# EAGLE design ep_project_1 (EAGLE 9.6.2)

## Sheet 1 of 2
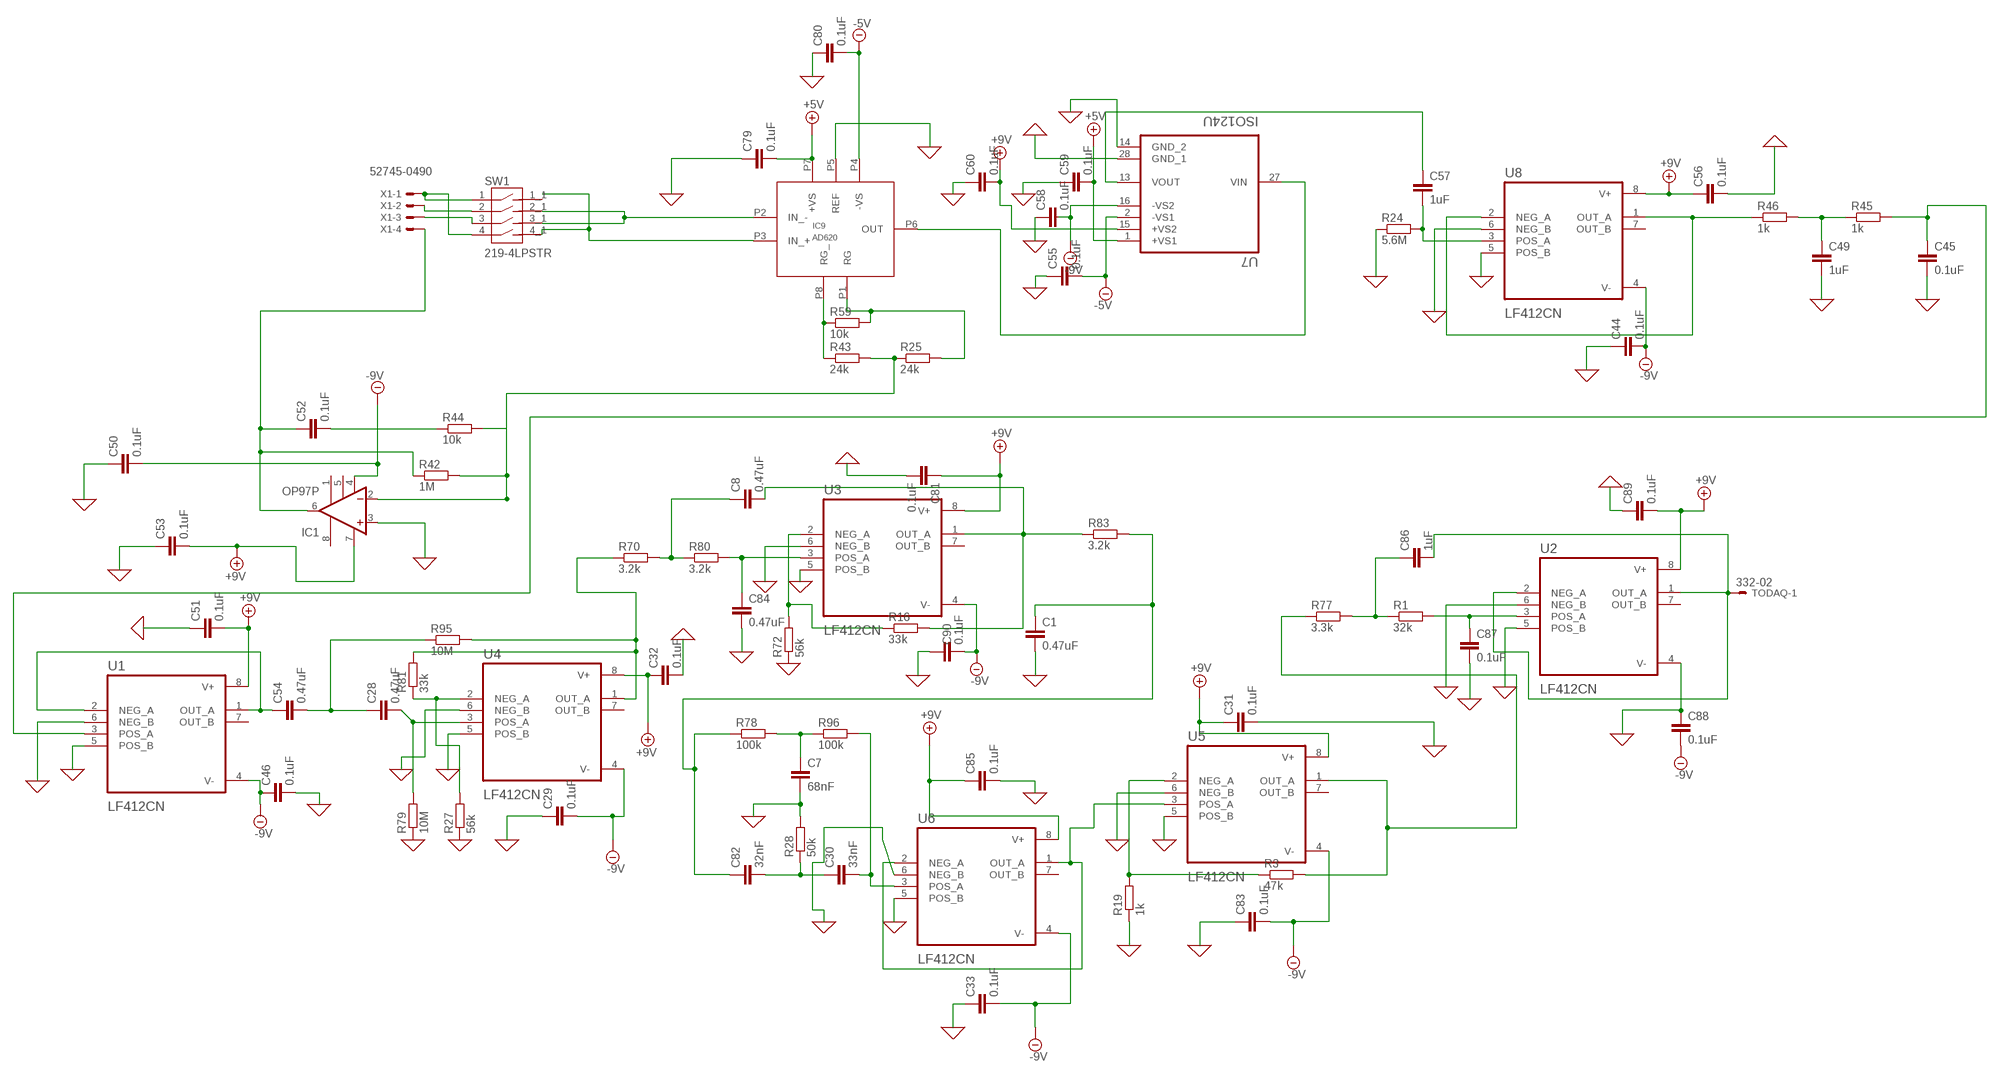
[diagram p0: schematic, sheet 1]

### Parts
C1  0.47uF  C-EU025-025X050  [C025-025X050]
C7  68nF  C-EU025-025X050  [C025-025X050]
C8  0.47uF  C-EU025-025X050  [C025-025X050]
C28  0.47uF  C-EU025-025X050  [C025-025X050]
C29  0.1uF  C-EU025-025X050  [C025-025X050]
C30  33nF  C-EU025-025X050  [C025-025X050]
C31  0.1uF  C-EU025-025X050  [C025-025X050]
C32  0.1uF  C-EU025-025X050  [C025-025X050]
C33  0.1uF  C-EU025-025X050  [C025-025X050]
C44  0.1uF  C-EU025-025X050  [C025-025X050]
C45  0.1uF  C-EU025-025X050  [C025-025X050]
C46  0.1uF  C-EU025-025X050  [C025-025X050]
C49  1uF  C-EU025-025X050  [C025-025X050]
C50  0.1uF  C-EU025-025X050  [C025-025X050]
C51  0.1uF  C-EU025-025X050  [C025-025X050]
C52  0.1uF  C-EU025-025X050  [C025-025X050]
C53  0.1uF  C-EU025-025X050  [C025-025X050]
C54  0.47uF  C-EU025-025X050  [C025-025X050]
C55  0.1uF  C-EU025-025X050  [C025-025X050]
C56  0.1uF  C-EU025-025X050  [C025-025X050]
C57  1uF  C-EU025-025X050  [C025-025X050]
C58  0.1uF  C-EU025-025X050  [C025-025X050]
C59  0.1uF  C-EU025-025X050  [C025-025X050]
C60  0.1uF  C-EU025-025X050  [C025-025X050]
C79  0.1uF  C-EU025-025X050  [C025-025X050]
C80  0.1uF  C-EU025-025X050  [C025-025X050]
C81  0.1uF  C-EU025-025X050  [C025-025X050]
C82  32nF  C-EU025-025X050  [C025-025X050]
C83  0.1uF  C-EU025-025X050  [C025-025X050]
C84  0.47uF  C-EU025-025X050  [C025-025X050]
C85  0.1uF  C-EU025-025X050  [C025-025X050]
C86  1uF  C-EU025-025X050  [C025-025X050]
C87  0.1uF  C-EU025-025X050  [C025-025X050]
C88  0.1uF  C-EU025-025X050  [C025-025X050]
C89  0.1uF  C-EU025-025X050  [C025-025X050]
C90  0.1uF  C-EU025-025X050  [C025-025X050]
IC1  OP97P  [DIL08]
IC9  AD620  [DIL8]
R1  32k  R-EU_0204/7  [0204/7]
R3  47k  R-EU_0204/7  [0204/7]
R16  33k  R-EU_VTA55  [VTA55]
R19  1k  R-EU_0204/7  [0204/7]
R24  5.6M  R-EU_0204/7  [0204/7]
R25  24k  R-EU_0204/7  [0204/7]
R27  56k  R-EU_0204/7  [0204/7]
R28  50k  R-EU_0204/7  [0204/7]
R42  1M  R-EU_0204/7  [0204/7]
R43  24k  R-EU_0204/7  [0204/7]
R44  10k  R-EU_0204/7  [0204/7]
R45  1k  R-EU_0204/7  [0204/7]
R46  1k  R-EU_0204/7  [0204/7]
R59  10k  R-EU_0204/7  [0204/7]
R70  3.2k  R-EU_0204/7  [0204/7]
R72  56k  R-EU_0204/7  [0204/7]
R77  3.3k  R-EU_0204/7  [0204/7]
R78  100k  R-EU_0204/7  [0204/7]
R79  10M  R-EU_0204/7  [0204/7]
R80  3.2k  R-EU_0204/7  [0204/7]
R81  33k  R-EU_0204/7  [0204/7]
R83  3.2k  R-EU_0204/7  [0204/7]
R95  10M  R-EU_0204/7  [0204/7]
R96  100k  R-EU_0204/7  [0204/7]
SW1  219-4LPSTR  [SW_219-4LPSTR]
TODAQ  332-02  [332-02]
U1  LF412CN  [DIP794W45P254L959H508Q8]
U2  LF412CN  [DIP794W45P254L959H508Q8]
U3  LF412CN  [DIP794W45P254L959H508Q8]
U4  LF412CN  [DIP794W45P254L959H508Q8]
U5  LF412CN  [DIP794W45P254L959H508Q8]
U6  LF412CN  [DIP794W45P254L959H508Q8]
U7  ISO124U  [SOIC127P1033X265-8N]
U8  LF412CN  [DIP794W45P254L959H508Q8]
X1  52745-0490  [52745-0490]

### Nets
0: C1.2 C7.2 C29.1 C31.2 C32.2 C33.1 C44.1 C45.2 C46.2 C49.2 C50.1 C51.1 C53.1 C55.1 C56.2 C58.1 C59.1 C60.1 C79.1 C80.1 C81.2 C83.1 C84.2 C85.2 C87.2 C88.1 C89.1 C90.1 IC1.3(+IN) IC9.P5(REF) R19.1 R24.1 R27.1 R28.2 R72.1 R79.1 U1.5(POS_B) U1.6(NEG_B) U2.4(V-) U2.5(POS_B) U2.6(NEG_B) U3.5(POS_B) U3.6(NEG_B) U4.5(POS_B) U4.6(NEG_B) U5.5(POS_B) U5.6(NEG_B) U6.5(POS_B) U6.6(NEG_B) U7.14(GND_2) U7.28(GND_1) U8.5(POS_B) U8.6(NEG_B) ; supply symbol labelled GND
+5V: C59.2 C79.2 IC9.P7(+VS) U7.1(+VS1)
+9V: C31.1 C32.1 C51.2 C53.2 C56.1 C60.2 C81.1 C85.1 C89.2 IC1.7(V+) U1.8(V+) U2.8(V+) U3.8(V+) U4.8(V+) U5.8(V+) U6.8(V+) U7.15(+VS2) U8.8(V+)
-5V: C55.2 C80.2 IC9.P4(-VS) U7.2(-VS1)
-9V: C29.2 C33.2 C44.2 C46.1 C50.2 C58.2 C83.2 C88.2 C90.2 IC1.4(V-) U1.4(V-) U3.4(V-) U4.4(V-) U5.4(V-) U6.4(V-) U7.16(-VS2) U8.4(V-)
N$1: R3.2 R77.1 U5.1(OUT_A)
N$2: C45.1 R45.2 U1.3(POS_A)
N$4: IC9.P8(RG_) R43.1 R59.1
N$5: C52.2 R44.1
N$6: IC1.2(-IN) R25.1 R42.2 R43.2 R44.2
N$7: C28.2 R79.2 U4.3(POS_A)
N$8: C28.1 C54.2 R95.1
N$9: R27.2 R81.1 U4.2(NEG_A)
N$10: C30.2 R96.2 U6.3(POS_A)
N$11: C1.1 C82.1 R78.1 R83.2
N$12: C7.1 R78.2 R96.1
N$13: IC9.P6(OUT) U7.27(VIN)
N$14: C30.1 C82.2 R28.1
N$15: U5.3(POS_A) U6.1(OUT_A) U6.2(NEG_A)
N$16: R3.1 R19.2 U5.2(NEG_A)
N$17: C49.1 R45.1 R46.2
N$18: C8.1 R70.2 R80.1
N$19: C84.1 R80.2 U3.3(POS_A)
N$20: R16.1 R72.2 U3.2(NEG_A)
N$21: C86.1 R1.1 R77.2
N$22: IC9.P3(IN_+) SW1.4_1
N$23: IC9.P2(IN_-) SW1.2_1 SW1.3_1
N$24: IC9.P1(RG) R25.2 R59.2
N$26: SW1.1 SW1.4 X1.1
N$27: C57.1 U7.13(VOUT)
N$28: C8.2 R16.2 R83.1 U3.1(OUT_A)
N$29: C87.1 R1.2 U2.3(POS_A)
N$30: SW1.3 X1.3
N$31: C54.1 U1.1(OUT_A) U1.2(NEG_A)
N$33: SW1.2 X1.2
N$34: R70.1 R81.2 R95.2 U4.1(OUT_A)
N$35: C52.1 IC1.6(OUT) R42.1 X1.4
N$36: C57.2 R24.2 U8.3(POS_A)
N$37: R46.1 U8.1(OUT_A) U8.2(NEG_A)
N$38: C86.2 TODAQ.1 U2.1(OUT_A) U2.2(NEG_A)
Unconnected: IC1.1(BAL1) IC1.5(COMP) IC1.8(BAL2) SW1.1_1 TODAQ.2 U1.7(OUT_B) U2.7(OUT_B) U3.7(OUT_B) U4.7(OUT_B) U5.7(OUT_B) U6.7(OUT_B) U8.7(OUT_B)

## Sheet 2 of 2

## Library data of the parts
C1 C7 C8 C28-C33 C44-C46 C49-C60 C79-C90 = rcl:C-EU: CAPACITOR, European symbol; SPICEPREFIX: C
IC1 = linear:OP97: Low Power, High Precision Operational Amplifier Source: http://www.analog.com/static/imported-files/data_sheets/OP97.pdf
IC9 = ad620:AD620
R1 R3 R16 R19 R24 R25 R27 R28 R42-R46 R59 R70 R72 R77-R81 R83 R95 R96 = rcl:R-EU_: RESISTOR, European symbol; SPICEPREFIX: R
SW1 = 219-4LPSTR:219-4LPSTR: Switch DIP ON OFF SPST 4 Flush Slide 0.1A 20VDC Gull Wing 2.54mm SMD T/R Check availability <https://pricing.snapeda.com/parts/219-4LPSTR/CTS%20Electrocomponents/view-part?ref=eda> Check availability <https://pricing.snapeda.com/parts/219-4LPSTR/CTS%20Electrocomponents/view-part?ref=eda>; AVAILABILITY: In Stock; CHECK_PRICES: https://www.snapeda.com/parts/219-4LPSTR/CTS+Electrocomponents/view-part/?ref=eda; DESCRIPTION: Dip Switch SPST 4 Position Surface Mount Slide (Standard) Actuator 100mA 20VDC; MF: CTS Electrocomponents; MP: 219-4LPSTR; PACKAGE: None; PRICE: None; PURCHASE-URL: https://www.snapeda.com/api/url_track_click_mouser/?unipart_id=615801&manufacturer=CTS Electrocomponents&part_name=219-4LPSTR&search_term=dip switch 4; SNAPEDA_LINK: https://www.snapeda.com/parts/219-4LPSTR/CTS+Electrocomponents/view-part/?ref=snap
TODAQ = con-garry:332-02: 2 Pin - 2mm Dual Row Source: www.mpe-connector.de / garry_shortform_2012.pdf
U1-U6 U8 = LF412CN (1):LF412CN: Check availability <https://pricing.snapeda.com/parts/LF412CN/Texas%20Instruments/view-part?ref=eda>; AVAILABILITY: In Stock; CHECK_PRICES: https://www.snapeda.com/parts/LF412CN/Texas+Instruments/view-part/?ref=eda; DESCRIPTION: IC, OP AMP, DUAL JFET, DIP8, 412; Op Amp Type:High Speed; No. of Amplifiers:2; Slew Rate:15V/µs; Supply Voltage Range:10V to 36V; Amplifier Case Style:DIP; No. of Pins:8; Bandwidth:3MHz; Operating Temperature Min:0°C; Operating Temperature Max:70°C; MSL:MSL 1 - Unlimited; SVHC:No SVHC (20-Jun-2013); Amplifier Type:JFET Operational; Base Number:412; Device Marking:LF412CN; Gain Bandwidth:4MHz; IC Generic Number:412; IC Temperature Range:Commercial; Input Offset Voltage Max:3mV; Logic Function Number:412; Operating Temperature Range:0°C to +70°C; Operational Amplifier Features:Low Offset; Package / Case:DIP; Supply Voltage + Nom:15V; Supply Voltage Max:36V; Supply Voltage Min:10V; MF: Texas Instruments; MP: LF412CN; PACKAGE: DIP-8 Texas Instruments; PRICE: None; PURCHASE-URL: https://www.snapeda.com/api/url_track_click_mouser/?unipart_id=20575&manufacturer=Texas Instruments&part_name=LF412CN&search_term=lf412cn; SNAPEDA_LINK: https://www.snapeda.com/parts/LF412CN/Texas+Instruments/view-part/?ref=snap
U7 = ISO124U:ISO124U; CHECK_PRICES: https://www.snapeda.com/parts/ISO124U/Texas+Instruments/view-part/?ref=eda; DESCRIPTION: &plusmn;10-V input, precision voltage sensing low-cost isolated amplifier; MF: Texas Instruments; MP: ISO124U; PACKAGE: SOIC-8 Texas Instruments; PURCHASE-URL: https://www.snapeda.com/api/url_track_click_mouser/?unipart_id=2459575&manufacturer=Texas Instruments&part_name=ISO124U&search_term=iso124; SNAPEDA_LINK: https://www.snapeda.com/parts/ISO124U/Texas+Instruments/view-part/?ref=snap
X1 = con-molex:52745-0490: FFC/FPC-to-Board 0.50mm (.020") SMT Top Contact Right Angle, ZIF, Style Receptacle 52745 / 52435 Source: http://www.molex.com/product/ffc/52745.html; MF: MOLEX; MPN: 52745-0490; OC_FARNELL: unknown; OC_NEWARK: 61H4699

## Board
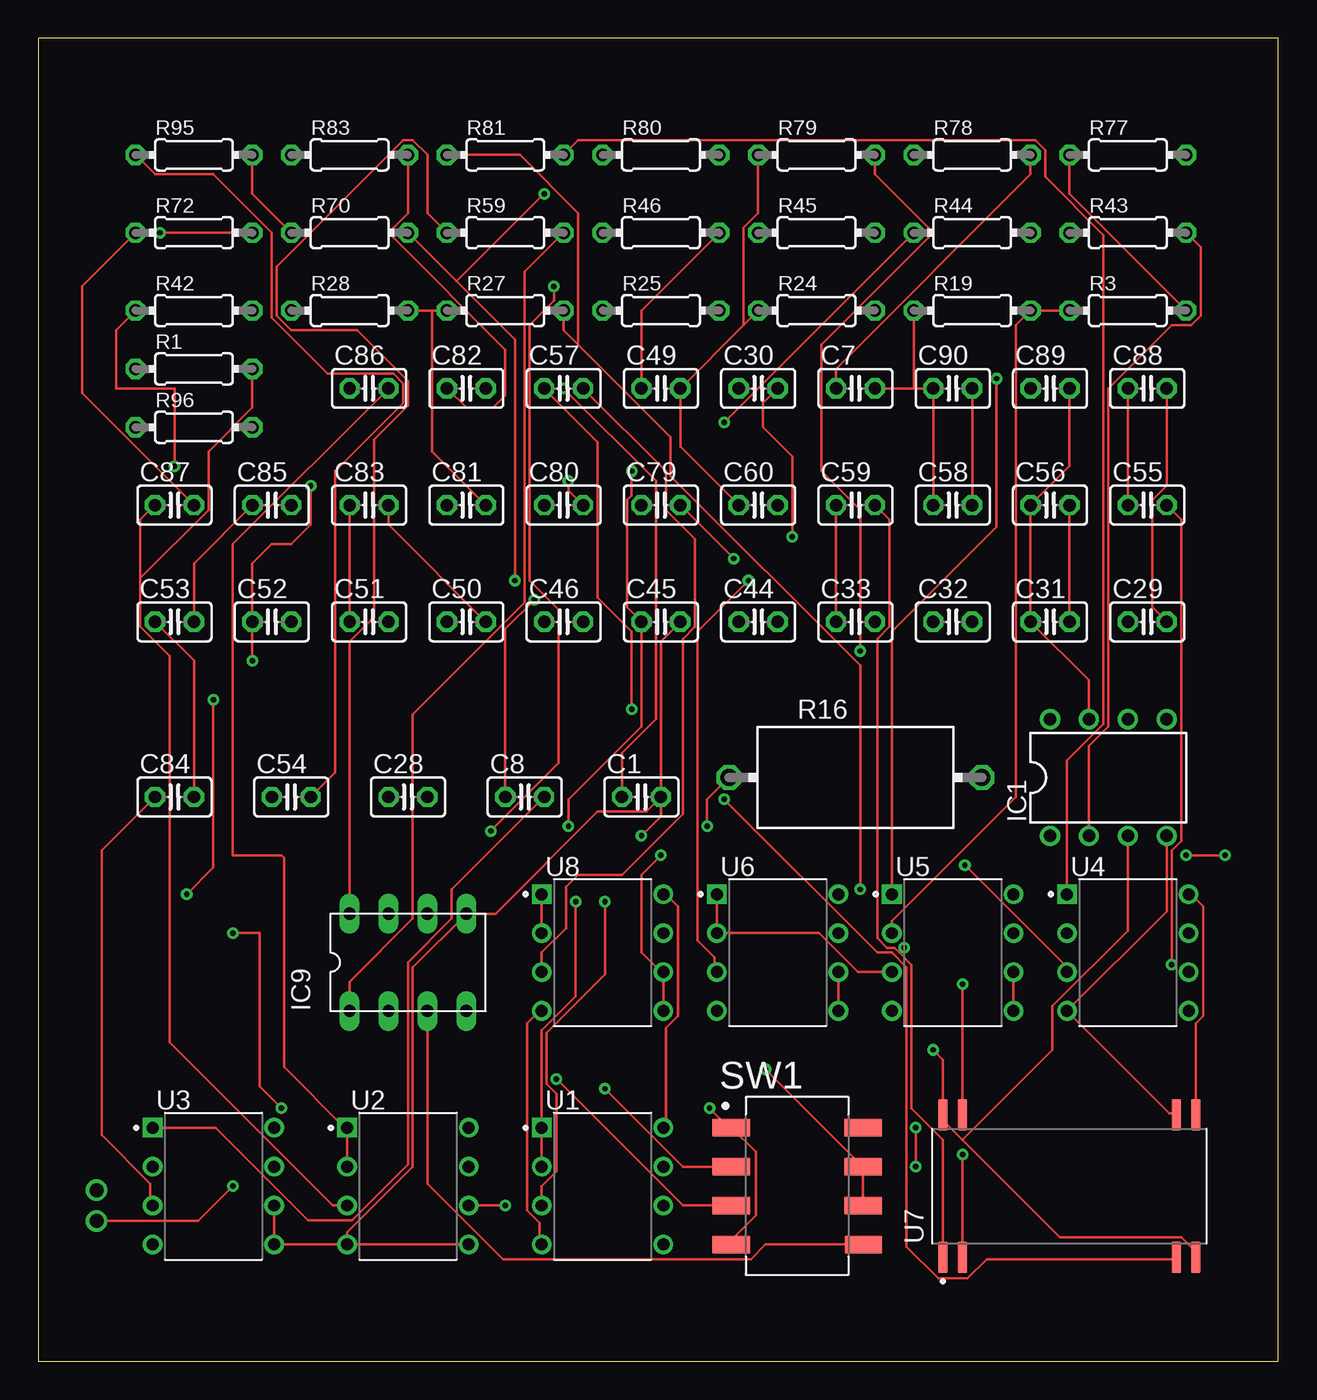
[diagram p1: board, top side]
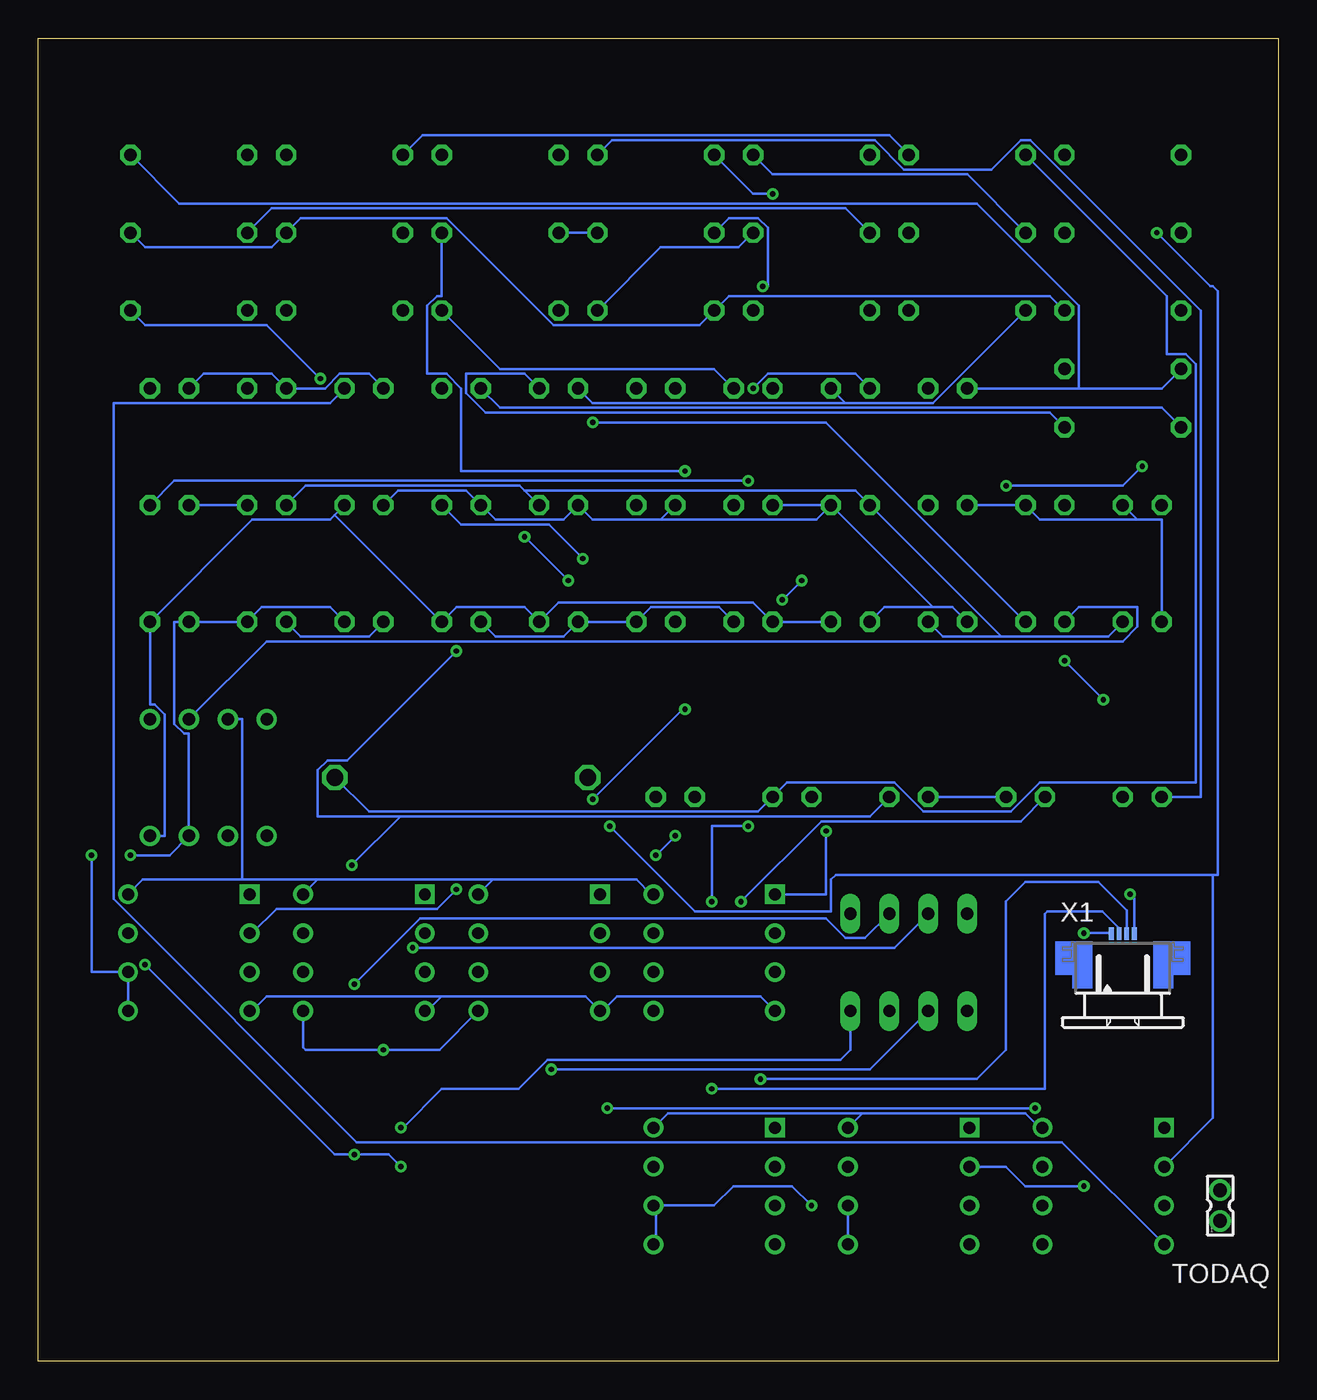
[diagram p2: board, bottom side, seen from below]

Size 80.95 x 86.35 mm. Coordinates in mm from the lower left corner, seen from the top.
Outline: 0,0 80.95,0 80.95,86.35 0,86.35 0,0
Copper layers (1*16): Top 0.035mm / dielectric 1.5mm / Bottom 0.035mm
Design rules "default": minimum track width 6mil, minimum drill 0.35mm, track to track 6mil, track to pad 6mil, pad to pad 6mil, via to via 6mil, smd to smd 6mil, copper to edge 40mil, drill to drill 6mil, minimum pad ring 10mil, minimum via ring 8mil, stop-mask expansion 4mil, vias tented up to drill 0mil, thermal gap 10mil

### Footprints (pad centres in the part's own frame; a part is rotated, then mirrored left to right if it is on the bottom)
C025-025X050 = drill 0.813 octagon: 1 -1.27,0; 2 1.27,0
DIL08 = drill 0.813 pad 1.27: 1 -3.81,-3.81; 2 -1.27,-3.81; 3 1.27,-3.81; 4 3.81,-3.81; 5 3.81,3.81; 6 1.27,3.81; 7 -1.27,3.81; 8 -3.81,3.81
DIL8 = drill 0.8 long: P1 -3.81,2.54; P2 -1.27,2.54; P3 1.27,2.54; P4 3.81,2.54; P5 3.81,8.89; P6 1.27,8.89; P7 -1.27,8.89; P8 -3.81,8.89
0204/7 = drill 0.813 octagon: 1 -3.81,0; 2 3.81,0
VTA55 = drill 1.1 octagon: 1 -8.255,0; 2 8.255,0
SW_219-4LPSTR = smd 2.44 x 1.13: 1 -4.305,3.81; 1_1 4.305,3.81; 2 -4.305,1.27; 2_1 4.305,1.27; 3 -4.305,-1.27; 3_1 4.305,-1.27; 4 -4.305,-3.81; 4_1 4.331,-3.81
332-02 = drill 0.9 pad 1.27: 1 0,-1; 2 0,1
DIP794W45P254L959H508Q8 = drill 0.78 pad 1.13 square: 1 -3.97,3.81 | drill 0.78 pad 1.13: 2 -3.97,1.27; 3 -3.97,-1.27; 4 -3.97,-3.81; 5 3.97,-3.81; 6 3.97,-1.27; 7 3.97,1.27; 8 3.97,3.81
SOIC127P1033X265-8N = smd 2.05 x 0.6: 1 -4.655,8.255; 2 -4.655,6.985; 13 -4.655,-6.985; 14 -4.655,-8.255; 15 4.655,-8.255; 16 4.655,-6.985; 27 4.655,6.985; 28 4.655,8.255
52745-0490 = smd 0.3 x 0.8: 1 -0.75,2.5; 2 -0.25,2.5; 3 0.25,2.5; 4 0.75,2.5

### Placement (x,y rotation side)
C1  39.37,36.83 0 top
C7  53.34,63.5 0 top
C8  31.75,36.83 0 top
C28  24.13,36.83 0 top
C29  72.39,48.26 0 top
C30  46.99,63.5 0 top
C31  66.04,48.26 0 top
C32  59.69,48.26 0 top
C33  53.34,48.26 0 top
C44  46.99,48.26 0 top
C45  40.64,48.26 0 top
C46  34.29,48.26 0 top
C49  40.64,63.5 0 top
C50  27.94,48.26 0 top
C51  21.59,48.26 0 top
C52  15.24,48.26 0 top
C53  8.89,48.26 0 top
C54  16.51,36.83 0 top
C55  72.39,55.88 0 top
C56  66.04,55.88 0 top
C57  34.29,63.5 0 top
C58  59.69,55.88 0 top
C59  53.34,55.88 0 top
C60  46.99,55.88 0 top
C79  40.64,55.88 0 top
C80  34.29,55.88 0 top
C81  27.94,55.88 0 top
C82  27.94,63.5 0 top
C83  21.59,55.88 0 top
C84  8.89,36.83 0 top
C85  15.24,55.88 0 top
C86  21.59,63.5 0 top
C87  8.89,55.88 0 top
C88  72.39,63.5 0 top
C89  66.04,63.5 0 top
C90  59.69,63.5 0 top
IC1  69.85,38.1 0 top
IC9  24.13,20.32 0 top
R1  10.16,64.77 0 top
R3  71.12,68.58 0 top
R16  53.34,38.1 0 top
R19  60.96,68.58 0 top
R24  50.8,68.58 0 top
R25  40.64,68.58 0 top
R27  30.48,68.58 0 top
R28  20.32,68.58 0 top
R42  10.16,68.58 0 top
R43  71.12,73.66 0 top
R44  60.96,73.66 0 top
R45  50.8,73.66 0 top
R46  40.64,73.66 0 top
R59  30.48,73.66 0 top
R70  20.32,73.66 0 top
R72  10.16,73.66 0 top
R77  71.12,78.74 0 top
R78  60.96,78.74 0 top
R79  50.8,78.74 0 top
R80  40.64,78.74 0 top
R81  30.48,78.74 0 top
R83  20.32,78.74 0 top
R95  10.16,78.74 0 top
R96  10.16,60.96 0 top
SW1  49.53,11.43 0 top
TODAQ  3.81,10.16 0 bottom
U1  36.83,11.43 0 top
U2  24.13,11.43 0 top
U3  11.43,11.43 0 top
U4  71.12,26.67 0 top
U5  59.69,26.67 0 top
U6  48.26,26.67 0 top
U7  67.31,11.43 90 top
U8  36.83,26.67 0 top
X1  10.16,25.4 0 bottom

### Tracks (layer width: path | path; a pad name or v marks a point on that pad's centre or on a via)
0  (via drill 0.35)
  Top 0.152: 60.33,14.45 66.67,8.1 74.61,8.1 75.56,7.14 U7.14 | 60.33,14.45 59.05,15.72 U7.28 59.05,19.68 v58.42,20.32 | C31.2 C56.2 | C55.1 C88.1 | 60.33,14.45 66.2,20.32 66.2,23.18 71.12,28.1 IC1.3 | R27.1 25.72,68.58 | 25.72,68.58 R28.2 | C83.1 C51.1 | 25.72,68.58 25.72,59.37 C81.2 | C84.2 10.16,45.72 C53.1 | C87.2 2.86,63.18 2.86,70.17 R72.1 | U2.4 20.16,8.41 24.45,12.7 24.45,25.72 IC9.P5 29.84,29.21 36.51,35.88 39.69,35.88 C1.2 | C1.2 40.64,46.99 C45.2 | R24.1 46.04,67.63 | 46.04,67.63 C49.2 41.91,59.69 C60.1 | R79.1 46.99,74.93 46.04,73.98 46.04,67.63 | C58.1 C90.1 57.15,63.5 | 57.15,63.5 C7.2 | 57.15,63.5 R19.1 | C59.1 C33.1 | U3.6 U3.5 U2.4 | U2.4 U2.5 | U2.6 v30.48,10.16 | U6.6 U6.5 | U8.5 U8.6 40.64,25.4 39.37,26.67 39.37,31.75 v40.64,33.02 | C1.2 40.64,35.56 v39.37,34.29 | U5.6 U5.5 | v77.47,33.02 v74.93,33.02
  Bottom 0.152: C88.1 70.17,64.45 65.72,64.45 C89.1 62.23,63.5 61.28,64.45 59.37,64.45 C90.1 | C55.1 C56.2 | C32.2 61.91,49.21 66.36,49.21 C31.2 C29.1 72.07,48.26 72.07,41.59 71.44,40.96 71.12,40.96 IC1.3 72.39,33.02 v74.93,33.02 | C50.1 25.72,49.21 22.54,49.21 | 22.54,49.21 21.27,49.21 C51.1 | C83.1 C85.2 15.56,54.93 9.21,54.93 | 22.54,49.21 C81.2 | C53.1 7.62,54.93 9.21,54.93 | C87.2 9.21,54.93 | C46.2 36.51,49.21 40.96,49.21 C45.2 C44.1 46.67,47.31 51.12,47.31 C33.1 | 40.32,54.93 C79.1 | 40.32,54.93 44.77,54.93 C60.1 46.67,54.93 51.12,54.93 C59.1 53.02,56.83 57.47,56.83 C58.1 | C81.2 30.16,54.93 40.32,54.93 | v30.48,10.16 31.75,11.43 35.56,11.43 36.83,10.16 40.64,10.16 | 40.64,10.16 U1.6 | v39.37,34.29 v40.64,33.02 | C81.2 C80.1 | U6.5 54.77,20.32 v58.42,20.32 63.5,20.32 63.66,20.48 U5.5 | U1.5 40.64,7.78 40.64,10.16 | U2.5 U2.6 | U4.5 U4.6 77.47,25.4 v77.47,33.02
+5V  (via drill 0.35)
  Top 0.152: U7.1 59.05,14.45 56.99,16.51 56.99,25.88 56.2,26.67 | 56.2,26.67 55.88,26.99 55.4,26.99 54.77,27.62 54.77,47.15 55.56,47.94 55.56,54.93 C59.2 | 56.2,26.67 v56.52,26.99 | v45.4,52.39 C79.2
  Bottom 0.152: IC9.P7 25.08,26.99 v56.52,26.99 | v45.4,52.39 47.62,54.61 53.34,54.61 C59.2
+9V
  Top 0.152: U7.15 75.56,22.07 76.04,22.54 76.04,29.69 75.25,30.48 U4.8 | U1.8 40.96,15.24 40.96,21.75 41.75,22.54 41.75,29.69 40.96,30.48 U8.8 | C53.2 10.16,52.07 C85.1 | IC1.7 68.58,44.45 C31.1 C56.1 67.31,58.42 C89.2
  Bottom 0.152: 27.15,16.19 16.51,16.19 15.56,15.24 U3.8 | 27.15,16.19 U2.8 | 27.15,16.19 39.85,16.19 U1.8 | 51.28,31.43 41.91,31.43 40.96,30.48 U8.8 | 51.28,31.43 U6.8 | 62.71,31.43 U5.8 | 51.28,31.43 62.71,31.43 | 62.71,31.43 67.63,31.43 | 67.63,31.43 74.14,31.43 U4.8 | C51.2 21.91,47.31 18.1,47.31 | 18.1,47.31 11.11,47.31 C53.2 | 18.1,47.31 C81.1 27.62,56.83 49.21,56.83 | C32.1 59.37,47.31 63.82,47.31 C31.1 | 49.21,56.83 49.53,57.15 63.5,57.15 C56.1 | 49.21,56.83 C60.2 | 67.63,31.43 67.63,41.91 IC1.7
-5V  (via drill 0.35)
  Top 0.152: v60.33,13.49 U7.2 | v73.98,25.88 73.98,33.34 74.61,33.97 74.61,54.93 C55.2 | v57.28,15.24 57.28,12.83 57.15,12.7 v57.28,12.7 | C80.2 34.61,56.83 v34.61,57.47
  Bottom 0.152: v73.98,25.88 61.59,13.49 v60.33,13.49 58.07,13.49 v57.28,12.7 | v34.61,57.47 72.07,57.47 C55.2 | IC9.P4 27.94,20.32 28.6,19.66 47.72,19.66 49.59,17.78 54.61,17.78 57.15,15.24 v57.28,15.24
-9V
  Top 0.152: C83.2 22.86,54.61 C50.2 | C88.2 73.66,57.15 72.71,56.2 72.71,49.21 C29.2 | U4.4 73.82,16.19 74.3,16.19 U7.16 | IC1.4 73.66,29.37 U4.4 | U4.4 | U1.4 32.7,7.62 32.7,9.05 31.91,9.84 31.91,22.07 32.7,22.86 U8.4 | C90.2 C58.2
  Bottom 0.152: C50.2 C46.1 34.29,49.53 46.99,49.53 C44.2 49.21,49.21 53.66,49.21 C33.2 61.59,55.24 | C58.2 61.59,55.24 | 61.59,55.24 61.91,54.93 66.99,54.93 C29.2 73.66,42.86 73.34,42.86 72.71,42.23 72.71,34.29 IC1.4 | 54.61,23.81 45.24,23.81 U6.4 44.13,22.86 43.18,23.81 33.81,23.81 U8.4 | 54.61,23.81 55.56,22.86 U5.4 | 54.61,23.81 66.04,23.81 66.99,22.86 U4.4 | C90.2 61.91,62.55 76.04,62.55 76.04,30.16 60.17,14.29 14.13,14.29 U3.4
N$1  (via drill 0.35)
  Top 0.152: v62.55,64.14 62.55,54.45 55.72,47.62 U5.1 | R77.1 67.31,76.2 R3.2
  Bottom 0.152: v62.55,64.14 66.04,67.63 73.98,67.63 R3.2
N$2  (via drill 0.35)
  Top 0.152: v36.99,30 36.99,25.24 33.18,21.43 33.18,18.1 33.81,17.46 33.81,12.38 32.86,11.43 U1.3 | v34.61,34.92 34.61,36.67 39.37,41.43 C45.1 38.42,49.21 38.42,56.2 38.73,56.52 v38.73,58.1
  Bottom 0.152: v36.99,30 36.99,34.92 v34.61,34.92 | R45.2 54.61,69.53 54.93,69.53 55.56,68.9 55.56,64.45 54.29,64.45 53.34,63.5 53.34,58.1 v38.73,58.1
N$4
  Top 0.152: IC9.P8 20.32,46.99 21.91,48.58 21.91,60.17 24.13,62.39 24.13,63.98 20.8,67.31 16.51,67.31 15.56,68.26 15.56,71.44 23.81,79.69 24.45,79.69 25.4,78.74 25.4,74.93 R59.1
  Bottom 0.152: R43.1 65.72,75.25 28.26,75.25 R59.1
N$5  (via drill 0.35)
  Top 0.152: R44.1 v44.77,61.28
  Bottom 0.152: C52.2 29.53,61.28 v44.77,61.28
N$6
  Top 0.152: IC1.2 68.58,40.16 69.85,41.43 69.85,63.5 73.98,67.63 75.25,67.63 75.88,68.26 75.88,72.71 R43.2
  Bottom 0.152: R42.2 14.92,69.53 35.88,69.53 R25.1 37.78,67.63 47.31,67.63 54.29,74.61 63.82,74.61 R44.2 65.72,72.71 73.98,72.71 R43.2
N$7  (via drill 0.35)
  Top 0.152: v60.48,32.38 66.99,25.88 66.99,25.4 U4.3 | R79.2 54.61,77.47 58.1,73.98 58.1,73.34 51.12,66.36 51.12,58.1 53.66,55.56 v53.66,46.35
  Bottom 0.152: 57.31,35.56 v60.48,32.38 | 57.31,35.56 26.67,35.56 C28.2 | v53.66,46.35 60.8,39.21 62.07,39.21 62.71,38.58 62.71,35.56 57.31,35.56
N$8
  Top 0.152: R95.1 7.62,77.47 11.43,77.47 15.24,73.66 15.24,68.1 18.89,64.45 23.18,64.45 23.81,63.82 23.81,62.55 19.37,58.1 19.37,38.42 C54.2
  Bottom 0.152: C28.1 C54.2
N$9  (via drill 0.35)
  Top 0.152: v53.66,30.8 53.66,45.4 41.27,57.78 41.27,60.33 35.24,66.36 | 35.24,66.36 34.29,67.31 R27.2 | R81.1 31.43,78.74 35.24,74.93 35.24,66.36
  Bottom 0.152: v53.66,30.8 54.93,29.53 65.41,29.53 66.99,27.94 U4.2
N$10  (via drill 0.35)
  Top 0.152: v46.35,50.96 43.02,47.62 43.02,27.46 44.13,26.35 44.13,25.4 U6.3 | v49.21,53.82 49.21,59.05 47.31,60.96 47.31,62.55 C30.2
  Bottom 0.152: v49.21,53.82 v46.35,50.96 | R96.2 14.92,61.91 51.75,61.91 53.02,63.18 53.02,64.45 49.21,64.45 C30.2
N$11  (via drill 0.35)
  Top 0.152: C1.1 38.1,39.69 40.32,41.91 40.32,57.47 v34.29,63.5 | R83.2 24.13,74.93 23.18,73.98 23.18,73.34 30.48,66.04 30.48,63.02 29.69,62.23 27.94,62.23 C82.1
  Bottom 0.152: R83.2 25.4,80.01 55.88,80.01 R78.1 | v34.29,63.5 33.34,64.45 27.62,64.45 C82.1
N$12
  Top 0.152: R78.2 64.77,77.47 52.07,64.77 C7.1
  Bottom 0.152: R96.1 7.62,62.23 50.8,62.23 C7.1
N$13  (via drill 0.35)
  Top 0.152: v60.33,24.61 U7.27
  Bottom 0.152: v60.33,24.61 56.04,28.89 29.53,28.89 28.26,27.62 26.99,27.62 IC9.P6
N$14
  Bottom 0.152: 28.26,62.55 C82.2 | 28.26,62.55 22.54,62.55 R28.1 | C30.1 44.77,62.55 28.26,62.55
N$15
  Top 0.152: U6.2 U6.1 | U5.3 53.5,25.4 50.96,27.94 U6.2 | U6.2
N$16
  Top 0.152: U5.2 55.72,28.73 63.82,36.83 63.82,67.63 R19.2 R3.1
N$17
  Top 0.152: C49.1 39.37,68.58 R46.2
  Bottom 0.152: R46.2 R45.1
N$18  (via drill 0.35)
  Top 0.152: C8.1 30.48,47.78 v32.38,49.69 | v31.11,50.96 31.11,66.67 27.3,70.48 | R70.2 27.3,70.48 | 27.3,70.48 v33.02,76.2
  Bottom 0.152: v31.11,50.96 v32.38,49.69 | R80.1 34.29,76.2 v33.02,76.2
N$19
  Top 0.152: C84.1 4.13,33.34 4.13,14.76 7.3,11.59 7.3,10.16 U3.3
  Bottom 0.152: R80.2 43.5,79.69 26.35,79.69 24.45,77.79 18.73,77.79 16.83,79.69 16.19,79.69 5.08,68.58 5.08,36.83 C84.1
N$20  (via drill 0.35)
  Top 0.152: v43.66,34.92 43.66,36.67 R16.1 | v7.94,73.66 R72.2
  Bottom 0.152: 4.29,31.75 4.29,15.87 U3.2 | 4.29,31.75 28.89,31.75 29.21,31.43 29.21,29.37 38.1,29.37 v43.66,34.92 | v7.94,73.66 4.45,70.17 4.29,70.17 3.97,69.85 3.97,31.75 4.29,31.75
N$21
  Bottom 0.152: R1.1 7.62,63.5 13.02,63.5 | C86.1 13.02,63.5 | R77.2 71.75,75.56 19.68,75.56 13.02,68.9 13.02,63.5
N$22
  Top 0.152: SW1.4_1 47.47,7.62 46.51,6.67 30.32,6.67 25.4,11.59 IC9.P3
N$23  (via drill 0.35)
  Top 0.152: 53.82,12.7 53.82,10.16 SW1.3_1 | 53.82,12.7 v47.47,19.05 | 53.82,12.7 SW1.2_1
  Bottom 0.152: IC9.P2 26.67,19.05 v47.47,19.05
N$24
  Top 0.152: IC9.P1 20.32,24.77 24.45,28.89 24.45,42.23 31.75,49.53 31.75,71.12 R59.2
  Bottom 0.152: R25.2 40.32,72.71 35.24,72.71 R59.2
N$26  (via drill 0.35)
  Top 0.152: v15.88,16.51 14.45,17.94 14.45,27.94 v12.7,27.94 | v43.81,16.51 45.09,15.24 SW1.1 45.24,15.24 46.83,13.65 46.83,9.53 45.24,7.94 45.24,7.62 SW1.4
  Bottom 0.152: v43.81,16.51 v15.88,16.51 | X1.1 10.95,27.94 v12.7,27.94
N$27  (via drill 0.35)
  Top 0.152: v44.77,36.67 54.77,26.67 55.72,26.67 56.67,25.72 56.67,7.46 58.74,5.4 60.64,5.4 61.91,6.67 74.3,6.67 U7.13 | v38.73,42.55 38.73,47.62 36.51,49.85 36.51,60.01 C57.1
  Bottom 0.152: v44.77,36.67 38.89,42.55 v38.73,42.55
N$28
  Top 0.152: U3.1 11.59,15.24 17.62,9.21 20.48,9.21 24.13,12.86 24.13,26.04 26.99,28.89 26.99,30.8 C8.2
  Bottom 0.152: R83.1 7.3,69.53 7.3,65.72 6.03,65.72 5.4,65.09 5.4,37.78 15.56,37.78 17.46,35.88 23.18,35.88 25.08,37.78 32.07,37.78 C8.2 33.97,35.88 59.37,35.88 R16.2
N$29
  Top 0.152: U2.3 19.21,10.16 8.57,20.8 8.57,46.04 6.67,47.94 6.67,51.12 | 6.67,51.12 6.67,54.93 C87.1 | R1.2 13.97,62.23 11.11,59.37 11.11,55.56 6.67,51.12
N$30  (via drill 0.35)
  Top 0.152: v33.81,18.41 42.07,10.16 SW1.3
  Bottom 0.152: X1.3 9.91,29.44 11.75,31.27 16.51,31.27 17.78,30 17.78,20.32 19.68,18.41 v33.81,18.41
N$31  (via drill 0.35)
  Top 0.152: U1.1 32.86,21.59 35.08,23.81 v35.08,30 | U1.1 | U1.2 U1.1
  Bottom 0.152: v35.08,30 29.84,35.24 16.83,35.24 C54.1
N$33  (via drill 0.35)
  Top 0.152: v36.99,17.78 42.07,12.7 SW1.2
  Bottom 0.152: X1.2 10.41,28.27 11.51,29.37 15.08,29.37 15.24,29.21 15.24,17.78 v36.99,17.78
N$34
  Top 0.152: R95.2 13.97,76.2 R70.1 | R81.2 35.24,79.69 65.09,79.69 65.72,79.06 65.72,77.31 69.53,73.5 69.53,41.59 67.15,39.21 U4.1
  Bottom 0.152: R70.1 20.32,77.47 33.02,77.47 R81.2
N$35  (via drill 0.35)
  Top 0.152: v11.43,43.18 11.43,32.23 v9.68,30.48 | v13.97,45.72 C52.1 13.97,52.07 15.24,53.34 16.51,53.34 17.78,54.61 v17.78,57.15 | R42.1 5.08,67.31 5.08,63.5 8.89,63.5 v8.89,58.42
  Bottom 0.152: IC1.6 66.04,46.99 10.16,46.99 9.21,47.94 9.21,49.21 13.02,49.21 C52.1 | v11.43,43.18 v13.97,45.72 | v8.89,58.42 10.16,57.15 v17.78,57.15 | v9.68,30.48 9.41,30.21 X1.4
N$36
  Top 0.152: C57.2 40.96,58.1 40.96,55.56 42.86,53.66 42.86,47.94 42.07,47.15 42.07,35.72 38.1,31.75 35.24,31.75 34.45,30.96 34.45,28.26 32.86,26.67 U8.3
  Bottom 0.152: R24.2 50.8,64.77 36.83,64.77 C57.2
N$37  (via drill 0.35)
  Top 0.152: U8.2 U8.1 | v33.66,70.17 33.66,69.22 32.07,67.63 32.07,50.96 33.97,49.05 33.97,39.05 v29.53,34.61
  Bottom 0.152: R46.1 35.88,74.61 33.97,74.61 33.34,73.98 33.34,70.17 v33.66,70.17 | v29.53,34.61 29.53,30.48 U8.1
N$38  (via drill 0.35)
  Top 0.152: U2.2 U2.1 20,15.24 16.03,19.21 16.03,32.86 15.88,33.02 12.7,33.02 12.7,53.34 C86.2 | v12.7,11.43 10.43,9.16 TODAQ.1
  Bottom 0.152: v12.7,11.43 16.51,11.43 17.78,12.7 U2.2